# Altium schematic sheet [2]-MCU_LPC1759FBD80.SchDoc: [2]-MCU_LPC1759FBD80
size A3; DocumentNumber: 2; Revision: 01-01-2020; SheetNumber: 2; SheetTotal: 6
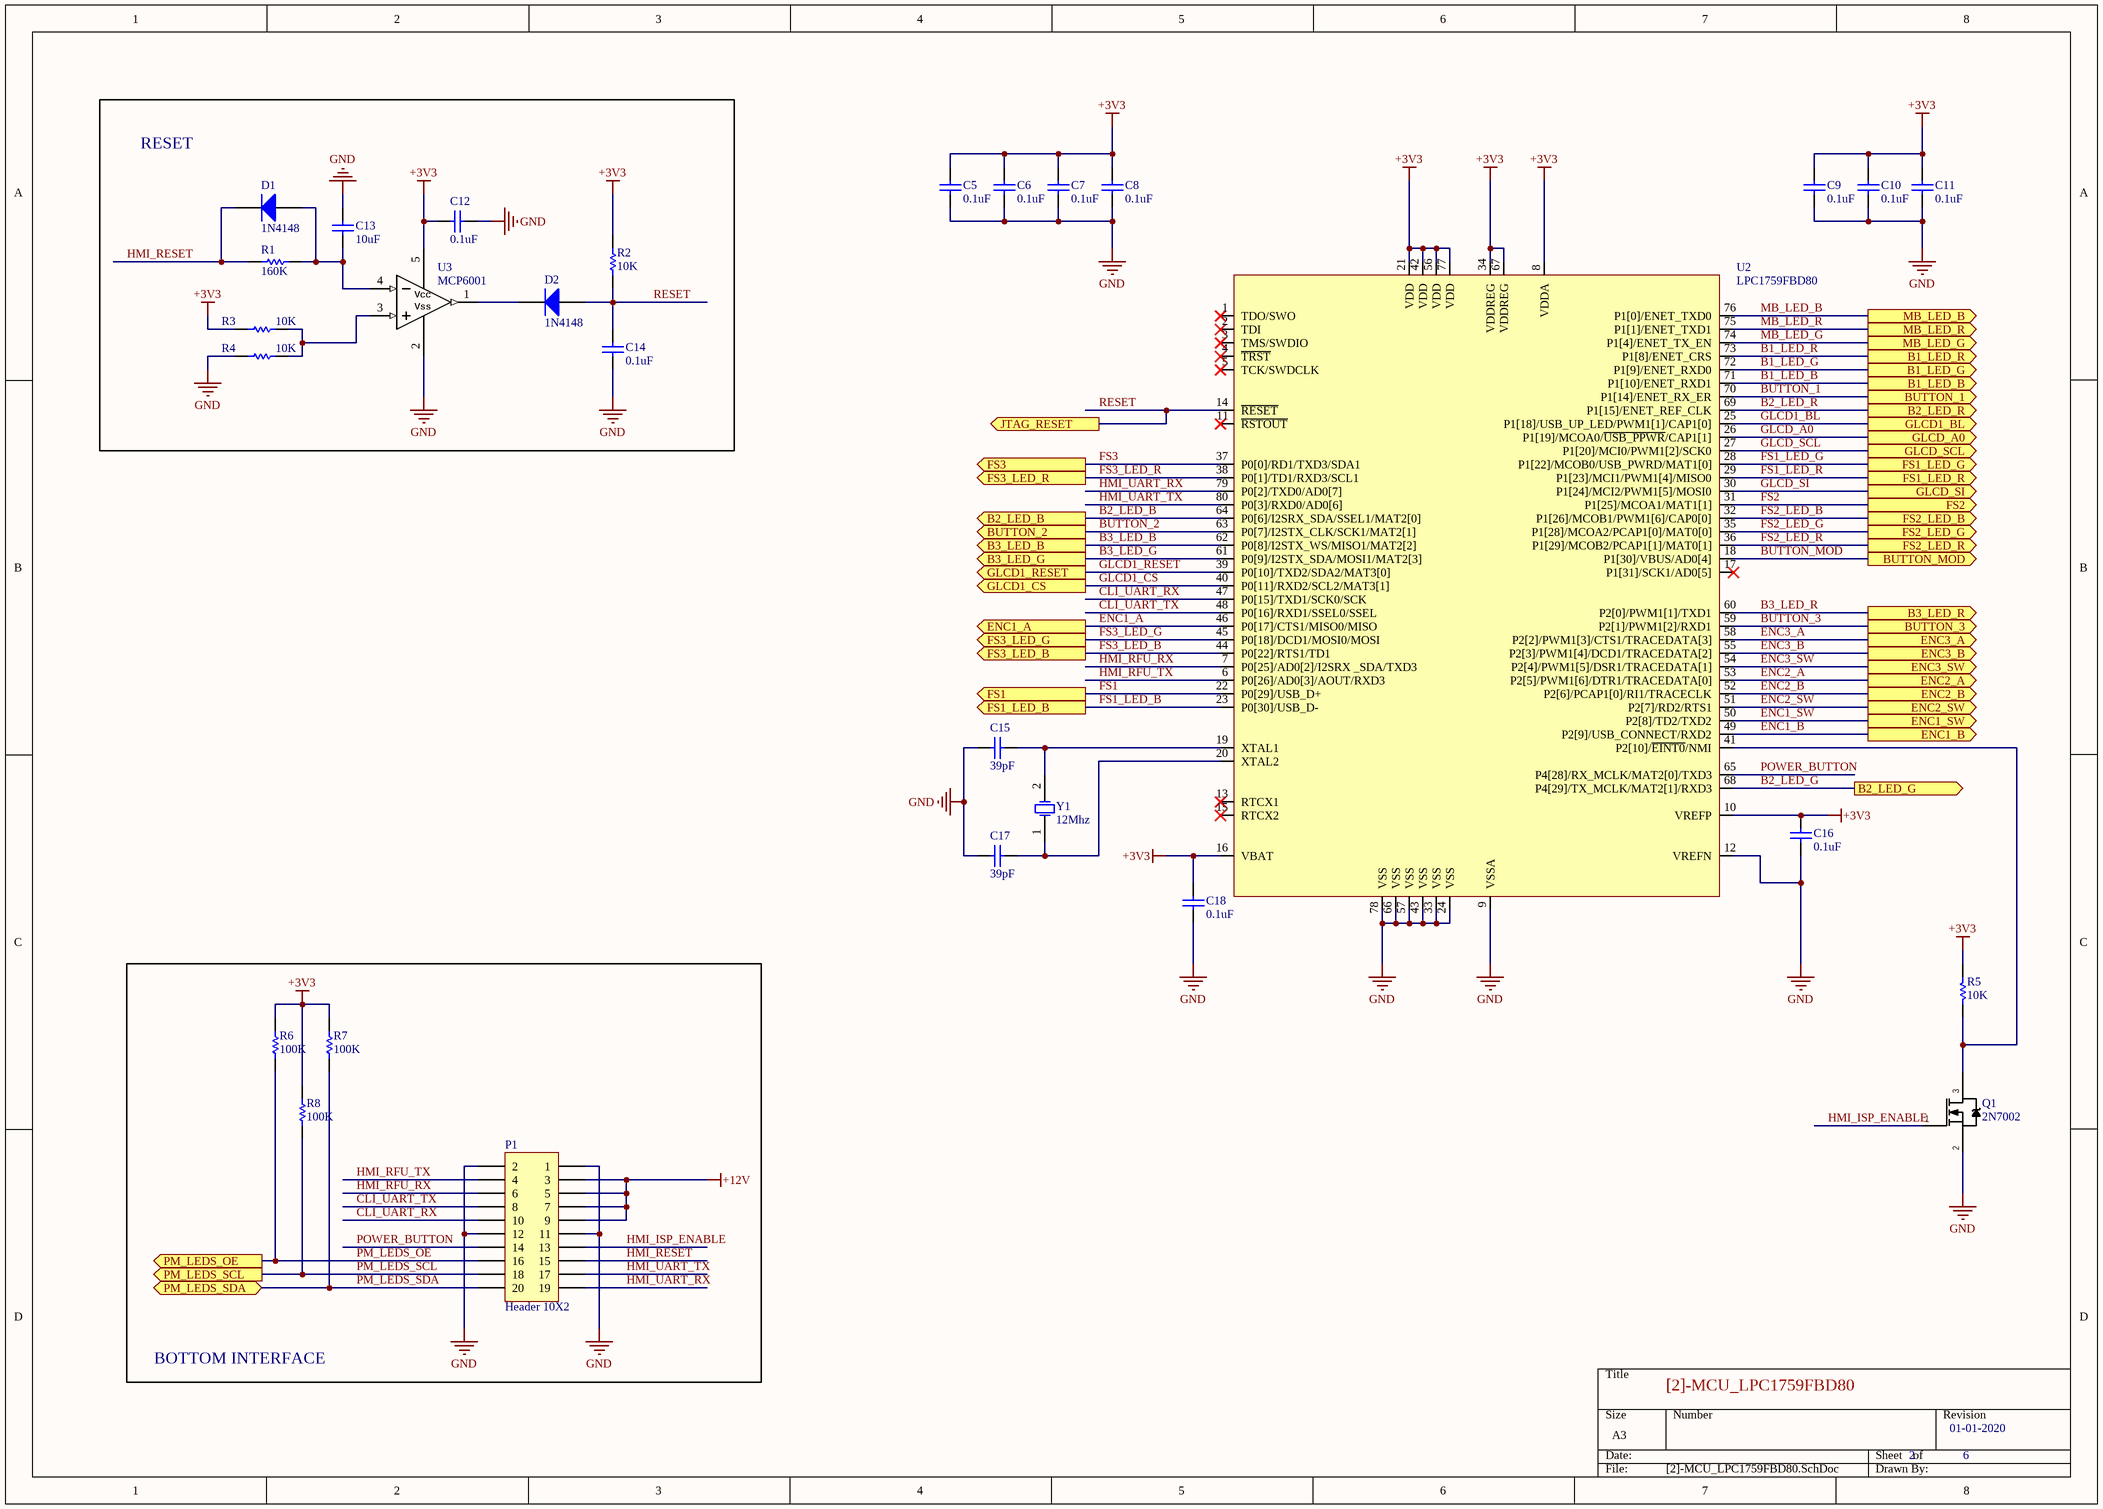
[diagram p0: [2]-MCU_LPC1759FBD80.SchDoc]

## Parts
C5  0.1uF  [CAPC1608N]
C6  0.1uF  [CAPC1608N]
C7  0.1uF  [CAPC1608N]
C8  0.1uF  [CAPC1608N]
C9  0.1uF  [CAPC1608N]
C10  0.1uF  [CAPC1608N]
C11  0.1uF  [CAPC1608N]
C12  0.1uF  [CAPC1608N]
C13  10uF  [CAPC1608N]
C14  0.1uF  [CAPC1608N]
C15  39pF  [CAPC1608N]
C16  0.1uF  [CAPC1608N]
C17  39pF  [CAPC1608N]
C18  0.1uF  [CAPC1608N]
D1  1N4148  [SOD-323]
D2  1N4148  [SOD-323]
P1  Header 10X2  [HDR2X10]
Q1  2N7002  [SOT23-3N]
R1  160K  [RESC1608N]
R2  10K  [RESC1608N]
R3  10K  [RESC1608N]
R4  10K  [RESC1608N]
R5  10K  [RESC1608N]
R6  100K  [RESC1608N]
R7  100K  [RESC1608N]
R8  100K  [RESC1608N]
U2  LPC1759FBD80  [LQFP80]
U3  MCP6001  [SOT23-5N]
Y1  12Mhz  [CRYSTAL_HC49SDLF]

## Blocks framed on the sheet
RESET: C12-C14 D1 D2 R1-R4 U3
BOTTOM INTERFACE: P1 R6-R8

## Ports
B1_LED_B (out), B1_LED_G (out), B1_LED_R (out), B2_LED_B (out), B2_LED_G (out), B2_LED_R (out), B3_LED_B (out), B3_LED_G (out), B3_LED_R (out), BUTTON_1 (out), BUTTON_2 (out), BUTTON_3 (out), BUTTON_MOD (out), ENC1_A (out), ENC1_B (out), ENC1_SW (out), ENC2_A (out), ENC2_B (out), ENC2_SW (out), ENC3_A (out), ENC3_B (out), ENC3_SW (out), FS1 (out), FS1_LED_B (out), FS1_LED_G (out), FS1_LED_R (out), FS2 (out), FS2_LED_B (out), FS2_LED_G (out), FS2_LED_R (out), FS3 (out), FS3_LED_B (out), FS3_LED_G (out), FS3_LED_R (out), GLCD1_BL (out), GLCD1_CS (out), GLCD1_RESET (out), GLCD_A0 (out), GLCD_SCL (out), GLCD_SI (out), JTAG_RESET (out), MB_LED_B (out), MB_LED_G (out), MB_LED_R (out), PM_LEDS_OE (out), PM_LEDS_SCL (out), PM_LEDS_SDA (bidir)

## Nets
+3V3: C5.2 C6.2 C7.2 C8.2 C9.2 C10.2 C11.2 C12.2 C16.2 C18.2 R2.1 R3.2 R5.1 R6.2 R7.2 R8.2 U2.8(VDDA) U2.10(VREFP) U2.16(VBAT) U2.21(VDD) U2.34(VDDREG) U2.42(VDD) U2.56(VDD) U2.67(VDDREG) U2.77(VDD) U3.5(VCC)
+12V: P1.3 P1.5 P1.7 P1.9
GND: C5.1 C6.1 C7.1 C8.1 C9.1 C10.1 C11.1 C12.1 C13.1 C14.2 C15.2 C16.1 C17.1 C18.1 P1.1 P1.2 P1.11 P1.12 Q1.2(S) R4.2 U2.9(VSSA) U2.12(VREFN) U2.24(VSS) U2.33(VSS) U2.43(VSS) U2.57(VSS) U2.66(VSS) U2.78(VSS) U3.2(VSS)
B1_LED_B: U2.71(P1[10]/ENET_RXD1) ; port B1_LED_B
B1_LED_G: U2.72(P1[9]/ENET_RXD0) ; port B1_LED_G
B1_LED_R: U2.73(P1[8]/ENET_CRS) ; port B1_LED_R
B2_LED_B: U2.64(P0[6]/I2SRX_SDA/SSEL1/MAT2[0]) ; port B2_LED_B
B2_LED_G: U2.68(P4[29]/TX_MCLK/MAT2[1]/RXD3) ; port B2_LED_G
B2_LED_R: U2.69(P1[15]/ENET_REF_CLK) ; port B2_LED_R
B3_LED_B: U2.62(P0[8]/I2STX_WS/MISO1/MAT2[2]) ; port B3_LED_B
B3_LED_G: U2.61(P0[9]/I2STX_SDA/MOSI1/MAT2[3]) ; port B3_LED_G
B3_LED_R: U2.60(P2[0]/PWM1[1]/TXD1) ; port B3_LED_R
BUTTON_1: U2.70(P1[14]/ENET_RX_ER) ; port BUTTON_1
BUTTON_2: U2.63(P0[7]/I2STX_CLK/SCK1/MAT2[1]) ; port BUTTON_2
BUTTON_3: U2.59(P2[1]/PWM1[2]/RXD1) ; port BUTTON_3
BUTTON_MOD: U2.18(P1[30]/VBUS/AD0[4]) ; port BUTTON_MOD
CLI_UART_RX: P1.10 U2.47(P0[15]/TXD1/SCK0/SCK)
CLI_UART_TX: P1.8 U2.48(P0[16]/RXD1/SSEL0/SSEL)
ENC1_A: U2.46(P0[17]/CTS1/MISO0/MISO) ; port ENC1_A
ENC1_B: U2.49(P2[9]/USB_CONNECT/RXD2) ; port ENC1_B
ENC1_SW: U2.50(P2[8]/TD2/TXD2) ; port ENC1_SW
ENC2_A: U2.53(P2[5]/PWM1[6]/DTR1/TRACEDATA[0]) ; port ENC2_A
ENC2_B: U2.52(P2[6]/PCAP1[0]/RI1/TRACECLK) ; port ENC2_B
ENC2_SW: U2.51(P2[7]/RD2/RTS1) ; port ENC2_SW
ENC3_A: U2.58(P2[2]/PWM1[3]/CTS1/TRACEDATA[3]) ; port ENC3_A
ENC3_B: U2.55(P2[3]/PWM1[4]/DCD1/TRACEDATA[2]) ; port ENC3_B
ENC3_SW: U2.54(P2[4]/PWM1[5]/DSR1/TRACEDATA[1]) ; port ENC3_SW
FS1: U2.22(P0[29]/USB_D+) ; port FS1
FS1_LED_B: U2.23(P0[30]/USB_D-) ; port FS1_LED_B
FS1_LED_G: U2.28(P1[22]/MCOB0/USB_PWRD/MAT1[0]) ; port FS1_LED_G
FS1_LED_R: U2.29(P1[23]/MCI1/PWM1[4]/MISO0) ; port FS1_LED_R
FS2: U2.31(P1[25]/MCOA1/MAT1[1]) ; port FS2
FS2_LED_B: U2.32(P1[26]/MCOB1/PWM1[6]/CAP0[0]) ; port FS2_LED_B
FS2_LED_G: U2.35(P1[28]/MCOA2/PCAP1[0]/MAT0[0]) ; port FS2_LED_G
FS2_LED_R: U2.36(P1[29]/MCOB2/PCAP1[1]/MAT0[1]) ; port FS2_LED_R
FS3: U2.37(P0[0]/RD1/TXD3/SDA1) ; port FS3
FS3_LED_B: U2.44(P0[22]/RTS1/TD1) ; port FS3_LED_B
FS3_LED_G: U2.45(P0[18]/DCD1/MOSI0/MOSI) ; port FS3_LED_G
FS3_LED_R: U2.38(P0[1]/TD1/RXD3/SCL1) ; port FS3_LED_R
GLCD1_BL: U2.25(P1[18]/USB_UP_LED/PWM1[1]/CAP1[0]) ; port GLCD1_BL
GLCD1_CS: U2.40(P0[11]/RXD2/SCL2/MAT3[1]) ; port GLCD1_CS
GLCD1_RESET: U2.39(P0[10]/TXD2/SDA2/MAT3[0]) ; port GLCD1_RESET
GLCD_A0: U2.26(P1[19]/MCOA0/~{USB_PPWR}/CAP1[1]) ; port GLCD_A0
GLCD_SCL: U2.27(P1[20]/MCI0/PWM1[2]/SCK0) ; port GLCD_SCL
GLCD_SI: U2.30(P1[24]/MCI2/PWM1[5]/MOSI0) ; port GLCD_SI
HMI_ISP_ENABLE: P1.13 Q1.1(G)
HMI_RESET: D1.1(K) P1.15 R1.1
HMI_RFU_RX: P1.6 U2.7(P0[25]/AD0[2]/I2SRX__SDA/TXD3)
HMI_RFU_TX: P1.4 U2.6(P0[26]/AD0[3]/AOUT/RXD3)
HMI_UART_RX: P1.19 U2.79(P0[2]/TXD0/AD0[7])
HMI_UART_TX: P1.17 U2.80(P0[3]/RXD0/AD0[6])
MB_LED_B: U2.76(P1[0]/ENET_TXD0) ; port MB_LED_B
MB_LED_G: U2.74(P1[4]/ENET_TX_EN) ; port MB_LED_G
MB_LED_R: U2.75(P1[1]/ENET_TXD1) ; port MB_LED_R
PM_LEDS_OE: P1.16 R6.1 ; port PM_LEDS_OE
PM_LEDS_SCL: P1.18 R8.1 ; port PM_LEDS_SCL
PM_LEDS_SDA: P1.20 R7.1 ; port PM_LEDS_SDA
POWER_BUTTON: P1.14 U2.65(P4[28]/RX_MCLK/MAT2[0]/TXD3)
RESET: C14.1 D2.2(A) R2.2 U2.14(~{RESET}) ; port JTAG_RESET
NetC13_2: C13.2 D1.2(A) R1.2 U3.4(IN-)
NetC15_1: C15.1 U2.19(XTAL1) Y1.2(OSC2)
NetC17_2: C17.2 U2.20(XTAL2) Y1.1(OSC1)
NetD2_1: D2.1(K) U3.1(OUT)
NetQ1_3: Q1.3(D) R5.2 U2.41(P2[10]/~{EINT0}/NMI)
NetR3_1: R3.1 R4.1 U3.3(IN+)

Not connected (* = marked no-connect by the designer): U2 1(TDO/SWO)* 2(TDI)* 3(TMS/SWDIO)* 4(~{TRST})* 5(TCK/SWDCLK)* 11(~{RSTOUT})* 13(RTCX1)* 15(RTCX2)* 17(P1[31]/SCK1/AD0[5])*

## Notes on the sheet
- (in symbol IC_MCP6001T-I/OT) Vcc; Vss

## Library data of the parts
C5-C12 C14 C16 C18 = CC0603KRX7R8BB104: CAP CER 0.1UF 25V X7R 0603; Manufacturer 1: Yageo; Capacitance: 100nF; Tolerance: 10%; Supplier 1: Digi-Key; Manufacturer Part Number 1: CC0603KRX7R8BB104; Stock 1: 40000; Pricing 1: 1=0.1, 10=0.074, 100=0.0329, 500=0.02352, 1000=0.01848 (USD); Mount: Surface Mount; Case/Package: 0603; Number of Pins: 2; Case Code (Imperial): 0603; Case Code (Metric): 1608; Min Operating Temperature: -55°C; Max Operating Temperature: 125°C; Dielectric: X7R; Voltage Rating: 25V; Packaging: Tape and Reel; Package Quantity: 1; Voltage Rating (DC): 25V; Termination: SMD/SMT; Composition: Ceramic; Voltage: 25V; Length: 1.6mm; Height: 0.8mm; Width: 0.8mm; Thickness: 0.035inch; Depth: 0.8mm; Radiation Hardening: No; REACH SVHC: Unknown; Lead Free: Lead Free; Halogen Free: Halogen Free; ComponentLink1URL: https://datasheet.ciiva.com/11786/0900766b80c10176-11786120.pdf; ComponentLink1Description: https://datasheet.ciiva.com/11786/0900766b80c10176-11786120.pdf; ComponentLink2URL: https://datasheet.ciiva.com/144/mlccorderingcode-144075.pdf; ComponentLink2Description: https://datasheet.ciiva.com/144/mlccorderingcode-144075.pdf; ComponentLink3URL: https://datasheet.ciiva.com/17434/upy-gphc-x7r-6-3v-to-50v-8-17434263.pdf; ComponentLink3Description: https://datasheet.ciiva.com/17434/upy-gphc-x7r-6-3v-to-50v-8-17434263.pdf; ComponentLink4URL: https://datasheet.ciiva.com/26829/getdatasheetpartid-403577-26829431.pdf; ComponentLink4Description: https://datasheet.ciiva.com/26829/getdatasheetpartid-403577-26829431.pdf; ComponentLink5URL: https://datasheet.ciiva.com/11587/upy-gphc-x7r-6-3v-to-50v-8-11587208.pdf; ComponentLink5Description: https://datasheet.ciiva.com/11587/upy-gphc-x7r-6-3v-to-50v-8-11587208.pdf; ComponentLink6URL: https://datasheet.ciiva.com/13389/upy-gphc-x7r-6-3v-to-50v-8-13389352.pdf; ComponentLink6Description: https://datasheet.ciiva.com/13389/upy-gphc-x7r-6-3v-to-50v-8-13389352.pdf; ComponentLink7URL: https://datasheet.ciiva.com/28450/1489800-28450584.pdf; ComponentLink7Description: https://datasheet.ciiva.com/28450/1489800-28450584.pdf; ComponentLink8URL: https://datasheet.ciiva.com/144/mlccorderingcode-144073.pdf; ComponentLink8Description: https://datasheet.ciiva.com/144/mlccorderingcode-144073.pdf; ComponentLink9URL: https://datasheet.ciiva.com/144/mlccorderingcode-144074.pdf; ComponentLink9Description: https://datasheet.ciiva.com/144/mlccorderingcode-144074.pdf; ComponentLink10URL: https://datasheet.ciiva.com/7978/1489800-7978155.pdf; ComponentLink10Description: https://datasheet.ciiva.com/7978/1489800-7978155.pdf; Supplier Part Number 1: 311-1341-1-ND
C13 = GRM188R61A106KE69D: CAP CER 10UF 10V X5R 0603; Manufacturer 1: Murata; Tolerance: 10%; Supplier 1: Digi-Key; Manufacturer Part Number 1: GRM188R61A106KE69D; Stock 1: 40000; Pricing 1: 1=0.22, 10=0.149, 100=0.0754, 500=0.05158, 1000=0.04563 (USD); Mount: Surface Mount; Case/Package: 0603; Case Code (Metric): 1608; Case Code (Imperial): 0603; Min Operating Temperature: -55°C; Max Operating Temperature: 85°C; Capacitance: 10uF; Packaging: Tape and Reel; Dielectric: X5R; Voltage Rating: 10V; Voltage: 10V; Voltage Rating (DC): 10V; Length: 1.6mm; Height: 0.8mm; Width: 0.031inch; Thickness: 0.037inch; Depth: 0.8mm; REACH SVHC: No SVHC; Lead Free: Lead Free; Supplier Part Number 1: 490-10474-1-ND
C15 C17 = C1608NP01H390J080AA: CAP CER 39PF 50V NP0 0603; Manufacturer 1: TDK; Tolerance: 5%; Dielectric: C0G; Supplier 1: Digi-Key; Manufacturer Part Number 1: C1608NP01H390J080AA; Stock 1: 1503; Pricing 1: 1=0.15, 10=0.106, 100=0.05, 500=0.03508, 1000=0.02904 (USD); Mount: Surface Mount; Case/Package: 0603; Weight: 7.1E-05oz; Case Code (Metric): 1608; Case Code (Imperial): 0603; Min Operating Temperature: -55°C; Max Operating Temperature: 150°C; Package Quantity: 4000; Packaging: Tape and Reel; Capacitance: 39pF; Voltage Rating: 50V; Termination: SMD/SMT; Voltage Rating (DC): 50V; Length: 0.063inch; Height: 0.8mm; Width: 0.031inch; Thickness: 0.035inch; Supplier Part Number 1: 445-14077-1-ND
D1 D2 = 1N4148WS-7-F: DIODE SWITCHING 75V 0.15A SOD323; Manufacturer 1: Diodes; Forward Current: 300mA; Reverse Recovery Time: 4ns; Element Configuration: Single; Forward Voltage: 1.25V; Peak Reverse Current: 1uA; Peak Non-Repetitive Surge Current: 2A; Average Rectified Current: 150mA; Power Dissipation: 200mW; Polarity: Standard; Capacitance: 2pF; Supplier 1: Digi-Key; Manufacturer Part Number 1: 1N4148WS-7-F; Stock 1: 557451; Pricing 1: 1=0.19, 10=0.171, 100=0.0932, 500=0.05736, 1000=0.03911 (USD); Mount: Surface Mount; Number of Pins: 2; Weight: 0.000173oz; Contact Plating: Tin,Matte; Min Operating Temperature: -65°C; Max Operating Temperature: 150°C; Max Repetitive Reverse Voltage (Vrrm): 75V; Max Forward Surge Current (Ifsm): 2A; Max Surge Current: 2A; Packaging: Tape and Reel; Recovery Time: 4ns; Package Quantity: 3000; Voltage Rating (DC): 75V; Power Rating: 200mW; Current Rating: 150mA; Output Current: 150mA; Voltage: 75V; Max Reverse Voltage (DC): 75V; Current: 2A; Length: 1.8mm; Height: 1mm; Width: 1.4mm; Radiation Hardening: No; REACH SVHC: No SVHC; Lead Free: Lead Free; ComponentLink1URL: https://datasheet.ciiva.com/16199/ds30097-16199061.pdf; ComponentLink1Description: https://datasheet.ciiva.com/16199/ds30097-16199061.pdf; ComponentLink2URL: https://datasheet.ciiva.com/16472/ds30097-16472599.pdf; ComponentLink2Description: https://datasheet.ciiva.com/16472/ds30097-16472599.pdf; ComponentLink3URL: https://datasheet.ciiva.com/1179/ds30097-1179355.pdf; ComponentLink3Description: https://datasheet.ciiva.com/1179/ds30097-1179355.pdf; ComponentLink4URL: https://datasheet.ciiva.com/8300/ds30097-8300396.pdf; ComponentLink4Description: https://datasheet.ciiva.com/8300/ds30097-8300396.pdf; ComponentLink5URL: https://datasheet.ciiva.com/911/ds30097-911741.pdf; ComponentLink5Description: https://datasheet.ciiva.com/911/ds30097-911741.pdf; ComponentLink6URL: https://datasheet.ciiva.com/911/ds30097-911742.pdf; ComponentLink6Description: https://datasheet.ciiva.com/911/ds30097-911742.pdf; ComponentLink7URL: https://datasheet.ciiva.com/25946/ds30097-25946926.pdf; ComponentLink7Description: https://datasheet.ciiva.com/25946/ds30097-25946926.pdf; ComponentLink8URL: https://datasheet.ciiva.com/911/ds30097-911743.pdf; ComponentLink8Description: https://datasheet.ciiva.com/911/ds30097-911743.pdf; Supplier Part Number 1: 1N4148WS-FDICT-ND
P1 = Header 10X2: Header, 10-Pin, Dual row; LatestRevisionDate: 17-Jul-2002; LatestRevisionNote: Re-released for DXP Platform.; Publisher: Altium Limited
Q1 = 2N7002: MOSFET N-CH 60V 115MA SOT-23; Manufacturer 1: ON Semiconductor / Fairchild; Max Power Dissipation: 200mW; Drain to Source Resistance: 1.2R; Gate to Source Voltage (Vgs): 20V; Nominal Vgs: 2.1V; Number of Elements: 1; Element Configuration: Single; Input Capacitance: 50pF; Rds On Max: 7.5R; On-State Resistance: 5.3R; Supplier 1: Digi-Key; Manufacturer Part Number 1: 2N7002; Stock 1: 111118; Pricing 1: 1=0.33, 10=0.304, 100=0.17, 500=0.09108, 1000=0.06193 (USD); Mount: Surface Mount; Case/Package: SOT-23; Number of Pins: 3; Contact Plating: Tin,Matte; Min Operating Temperature: -55°C; Max Operating Temperature: 150°C; Continuous Drain Current (ID): 115mA; Packaging: Tape and Reel; Package Quantity: 1; Drain to Source Voltage (Vdss): 60V; Drain to Source Breakdown Voltage: 60V; Power Dissipation: 200mW; Threshold Voltage: 2.1V; Voltage Rating (DC): 60V; Current Rating: 115mA; Dual Supply Voltage: 60V; Current: 115mA; Voltage: 60V; Length: 2.92mm; Height: 0.93mm; Width: 3.05mm; Radiation Hardening: No; REACH SVHC: No SVHC; Lead Free: Lead Free; ComponentLink1URL: https://datasheet.ciiva.com/931/2n7000-931777.pdf; ComponentLink1Description: https://datasheet.ciiva.com/931/2n7000-931777.pdf; ComponentLink2URL: https://datasheet.ciiva.com/27746/47-0120-27746881.pdf; ComponentLink2Description: https://datasheet.ciiva.com/27746/47-0120-27746881.pdf; ComponentLink3URL: https://datasheet.ciiva.com/1254/2n7002-1254451.pdf; ComponentLink3Description: https://datasheet.ciiva.com/1254/2n7002-1254451.pdf; ComponentLink4URL: https://datasheet.ciiva.com/15137/getdatasheetpartid-93547-15137771.pdf; ComponentLink4Description: https://datasheet.ciiva.com/15137/getdatasheetpartid-93547-15137771.pdf; ComponentLink5URL: https://datasheet.ciiva.com/931/2n7000-931762.pdf; ComponentLink5Description: https://datasheet.ciiva.com/931/2n7000-931762.pdf; ComponentLink6URL: https://datasheet.ciiva.com/931/2n7000-931763.pdf; ComponentLink6Description: https://datasheet.ciiva.com/931/2n7000-931763.pdf; ComponentLink7URL: https://datasheet.ciiva.com/931/2n7000-931764.pdf; ComponentLink7Description: https://datasheet.ciiva.com/931/2n7000-931764.pdf; ComponentLink8URL: https://datasheet.ciiva.com/1254/660093-1254452.pdf; ComponentLink8Description: https://datasheet.ciiva.com/1254/660093-1254452.pdf; ComponentLink9URL: https://datasheet.ciiva.com/1188/660093-1188359.pdf; ComponentLink9Description: https://datasheet.ciiva.com/1188/660093-1188359.pdf; ComponentLink10URL: https://datasheet.ciiva.com/1188/660093-1188361.pdf; ComponentLink10Description: https://datasheet.ciiva.com/1188/660093-1188361.pdf; ComponentLink11URL: https://datasheet.ciiva.com/17007/2n7002-17007243.pdf; ComponentLink11Description: https://datasheet.ciiva.com/17007/2n7002-17007243.pdf; ComponentLink12URL: https://datasheet.ciiva.com/3304/nds7002a-3304380.pdf; ComponentLink12Description: https://datasheet.ciiva.com/3304/nds7002a-3304380.pdf; ComponentLink13URL: https://datasheet.ciiva.com/3304/nds7002a-3304381.pdf; ComponentLink13Description: https://datasheet.ciiva.com/3304/nds7002a-3304381.pdf; ComponentLink14URL: https://datasheet.ciiva.com/22655/660093-22655230.pdf; ComponentLink14Description: https://datasheet.ciiva.com/22655/660093-22655230.pdf; Supplier Part Number 1: 2N7002NCT-ND
R1 = RMCF0603JT160K: RES SMD 160K OHM 5% 1/10W 0603; Manufacturer 1: Stackpole Electronics; Resistance: 160kR; Power Rating: 100mW; Temperature Coefficient: 100ppm/°C; Supplier 1: Digi-Key; Manufacturer Part Number 1: RMCF0603JT160K; Stock 1: 10640; Pricing 1: 1=0.1, 10=0.016, 100=0.0064, 1000=0.00289, 2500=0.0025 (USD); Mount: Surface Mount; Case/Package: 0603; Case Code (Metric): 1608; Case Code (Imperial): 0603; Contact Plating: Tin,Matte; Min Operating Temperature: -55°C; Max Operating Temperature: 155°C; Tolerance: 5%; Packaging: Tape and Reel; Composition: Thick Film; Number of Terminations: 2; Max Power Dissipation: 100mW; Features: Automotive AEC-Q200; Length: 0.061inch; Height: 0.022inch; Width: 0.031inch; Radiation Hardening: No; Lead Free: Lead Free; Supplier Part Number 1: RMCF0603JT160KCT-ND
R2-R5 = AC0603JR-0710KL: RES SMD 10K OHM 5% 1/10W 0603; Manufacturer 1: Yageo; Voltage Rating: 50V; Resistance: 10kR; Power Rating: 100mW; Temperature Coefficient: 100ppm/°C; Supplier 1: Digi-Key; Manufacturer Part Number 1: AC0603JR-0710KL; Stock 1: 60451; Pricing 1: 1=0.1, 10=0.032, 100=0.0131, 1000=0.00588, 2500=0.0051 (USD); Case/Package: 0603; Case Code (Imperial): 0603; Case Code (Metric): 1608; Min Operating Temperature: -55°C; Max Operating Temperature: 155°C; Packaging: Tape and Reel; Tolerance: 5%; Package Quantity: 1; Composition: Thick Film; Termination: SMD/SMT; Number of Terminations: 2; Military Standard: Not; Max Power Dissipation: 100mW; Features: Moisture Resistant,Automotive AEC-Q200,Anti-Sulfur; Length: 0.063inch; Height: 0.022inch; Width: 0.031inch; Depth: 0.8mm; Lead Free: Lead Free; ComponentLink1URL: https://datasheet.ciiva.com/5562/pyu-ac-51-rohs-l-2-5562553.pdf; ComponentLink1Description: https://datasheet.ciiva.com/5562/pyu-ac-51-rohs-l-2-5562553.pdf; Supplier Part Number 1: 311-10KLECT-ND
R6-R8 = ESR03EZPJ104: RES SMD 100K OHM 5% 1/4W 0603; Manufacturer 1: Rohm; Resistance: 100kR; Power Rating: 200mW; Max Power Dissipation: 250mW; Temperature Coefficient: 200ppm/°C; Supplier 1: Digi-Key; Manufacturer Part Number 1: ESR03EZPJ104; Stock 1: 17901; Pricing 1: 1=0.1, 10=0.087, 100=0.0333, 1000=0.01464, 2500=0.01264 (USD); Case/Package: 0603; Case Code (Metric): 1608; Case Code (Imperial): 0603; Min Operating Temperature: -55°C; Max Operating Temperature: 155°C; Tolerance: 5%; Package Quantity: 1; Packaging: Cut Tape; Composition: Thick Film; Number of Terminations: 2; Length: 0.063inch; Height: 0.022inch; Width: 0.031inch; Lead Free: Lead Free; ComponentLink1URL: https://datasheet.ciiva.com/14930/esr-14930633.pdf; ComponentLink1Description: https://datasheet.ciiva.com/14930/esr-14930633.pdf; ComponentLink2URL: https://datasheet.ciiva.com/14924/esr-14924811.pdf; ComponentLink2Description: https://datasheet.ciiva.com/14924/esr-14924811.pdf; ComponentLink3URL: https://datasheet.ciiva.com/14928/esr-14928813.pdf; ComponentLink3Description: https://datasheet.ciiva.com/14928/esr-14928813.pdf; Supplier Part Number 1: RHM100KDCT-ND
U2 = IC_LPC1759FBD80,551: IC MCU 32BIT 512KB FLASH 80LQFP; Manufacturer 1: NXP Semiconductors; Min Supply Voltage: 2.4V; Max Supply Voltage: 3.6V; Number of PWM Channels: 7; RAM Size: 64KB; Operating Supply Voltage: 3.3V; Number of ADC Channels: 6; Number of Timers/Counters: 4; Max Power Dissipation: 1.5W; Interface: I2C,SPI,USB,CAN,IrDA,SSP,UART,USART,Ethernet,I2S; Number of I/Os: 52; Frequency: 120MHz; Oscillator Type: Internal; Data Bus Width: 32b; Number of SPI Channels: 3; Number of I2C Channels: 2; Watchdog Timer: Yes; Peripherals: Brown-out Detect/Reset,POR,PWM,WDT,DMA,I2C; Core Architecture: ARM; Supplier 1: Digi-Key; Stock 1: 820; Pricing 1: 1=10.62000, 10=9.59500, 25=9.14920, 100=7.94410, 250=7.58712, 500=6.91766, 1000=6.02505 (USD); RoHS: Yes; Mount: Surface Mount; Case/Package: LQFP; Number of Pins: 80; Min Operating Temperature: -40°C; Max Operating Temperature: 85°C; Package Quantity: 119; Packaging: Tray; Number of UART Channels: 4; Number of Programmable I/O: 52; Max Frequency: 120MHz; Memory Type: FLASH; Memory Size: 512KB; Length: 12.1mm; Height: 1.5mm; Width: 12.1mm; Radiation Hardening: No; REACH SVHC: No SVHC; Lead Free: Lead Free; ComponentLink1URL: https://datasheet.ciiva.com/8010/1760709-8010161.pdf?src-supplier=Element14; ComponentLink1Description: https://datasheet.ciiva.com/8010/1760709-8010161.pdf?src-supplier=Element14; ComponentLink2URL: https://datasheet.ciiva.com/26818/lpc1759fbd80-551-26818650.pdf?src-supplier=IIIC; ComponentLink2Description: https://datasheet.ciiva.com/26818/lpc1759fbd80-551-26818650.pdf?src-supplier=IIIC; ComponentLink3URL: https://datasheet.ciiva.com/5700/1760709-5700186.pdf?src-supplier=Farnell; ComponentLink3Description: https://datasheet.ciiva.com/5700/1760709-5700186.pdf?src-supplier=Farnell; ComponentLink4URL: https://datasheet.ciiva.com/16378/lpc1759-58-56-54-52-51-16378523.pdf?src-supplier=Future+Electronics; ComponentLink4Description: https://datasheet.ciiva.com/16378/lpc1759-58-56-54-52-51-16378523.pdf?src-supplier=Future+Electronics; Supplier Part Number 1: 568-4968-ND; Manufacturer Part Number 1: LPC1759FBD80,551
U3 = IC_MCP6001T-I/OT: IC OPAMP GP 1MHZ RRO SOT23-5; Manufacturer 1: Microchip; Voltage Gain: 112dB; Min Supply Voltage: 1.8V; Max Supply Voltage: 6V; Common Mode Rejection Ratio: 60dB; Operating Supply Voltage: 5.5V; Slew Rate: 0.6V/µs; Nominal Supply Current: 100uA; Number of Channels: 1; Output Current: 23mA; Input Bias Current: 1pA; Input Offset Voltage (Vos): 4.5mV; Power Supply Rejection Ratio (PSRR): 86dB; Supplier 1: Digi-Key; Manufacturer Part Number 1: MCP6001T-I/OT; Stock 1: 3412; Pricing 1: 1=0.25, 25=0.206 (USD); Mount: Surface Mount; Case/Package: SOT-23; Number of Pins: 5; Contact Plating: Tin,Matte; Min Operating Temperature: -40°C; Max Operating Temperature: 85°C; Gain Bandwidth Product: 1MHz; Packaging: Tape and Reel; Bandwidth: 1MHz; Unity Gain Bandwidth Product: 1MHz; Package Quantity: 1; Number of Circuits: 1; Operating Supply Current: 100uA; Output Current per Channel: 23mA; Number of Elements: 1; Number of Amplifiers: 1; Voltage: 6V; Length: 3.1mm; Height: 1.3mm; Width: 1.8mm; Radiation Hardening: No; REACH SVHC: No SVHC; Lead Free: Lead Free; ComponentLink1URL: https://datasheet.ciiva.com/1793/21733j-1793040.pdf; ComponentLink1Description: https://datasheet.ciiva.com/1793/21733j-1793040.pdf; ComponentLink2URL: https://datasheet.ciiva.com/16199/filehandler-aspxddocname-en011705-16199408.pdf; ComponentLink2Description: https://datasheet.ciiva.com/16199/filehandler-aspxddocname-en011705-16199408.pdf; ComponentLink3URL: https://datasheet.ciiva.com/26344/651487-da-01-en-ic-opamp-mcp6001t-i-ot-sot-23-5-mcp-26344500.pdf; ComponentLink3Description: https://datasheet.ciiva.com/26344/651487-da-01-en-ic-opamp-mcp6001t-i-ot-sot-23-5-mcp-26344500.pdf; ComponentLink4URL: https://datasheet.ciiva.com/1793/21733j-1793041.pdf; ComponentLink4Description: https://datasheet.ciiva.com/1793/21733j-1793041.pdf; ComponentLink5URL: https://datasheet.ciiva.com/1793/21733j-1793042.pdf; ComponentLink5Description: https://datasheet.ciiva.com/1793/21733j-1793042.pdf; ComponentLink6URL: https://datasheet.ciiva.com/16796/jp011705-16796421.pdf; ComponentLink6Description: https://datasheet.ciiva.com/16796/jp011705-16796421.pdf; ComponentLink7URL: https://datasheet.ciiva.com/8078/524878-8078826.pdf; ComponentLink7Description: https://datasheet.ciiva.com/8078/524878-8078826.pdf; ComponentLink8URL: https://datasheet.ciiva.com/14544/70045422-14544795.pdf; ComponentLink8Description: https://datasheet.ciiva.com/14544/70045422-14544795.pdf; ComponentLink9URL: https://datasheet.ciiva.com/8078/524878-8078829.pdf; ComponentLink9Description: https://datasheet.ciiva.com/8078/524878-8078829.pdf; ComponentLink10URL: https://datasheet.ciiva.com/14151/mcp6001-2-4-eng-tds-14151487.pdf; ComponentLink10Description: https://datasheet.ciiva.com/14151/mcp6001-2-4-eng-tds-14151487.pdf; Supplier Part Number 1: MCP6001T-I/OTCT-ND
Y1 = FC4SDCBMF12.0-T1: CRYSTAL 12.0000MHZ 20PF SMD; Manufacturer 1: Fox Electronics; Supplier 1: Digi-Key; Manufacturer Part Number 1: FC4SDCBMF12.0-T1; Stock 1: 37233; Pricing 1: 1=0.32, 10=0.263, 50=0.2364, 100=0.2102, 500=0.1997 (USD); Supplier Part Number 1: 631-1013-1-ND